# EAGLE design IO_Module (EAGLE 7.7.0)

## Sheet 1 of 3
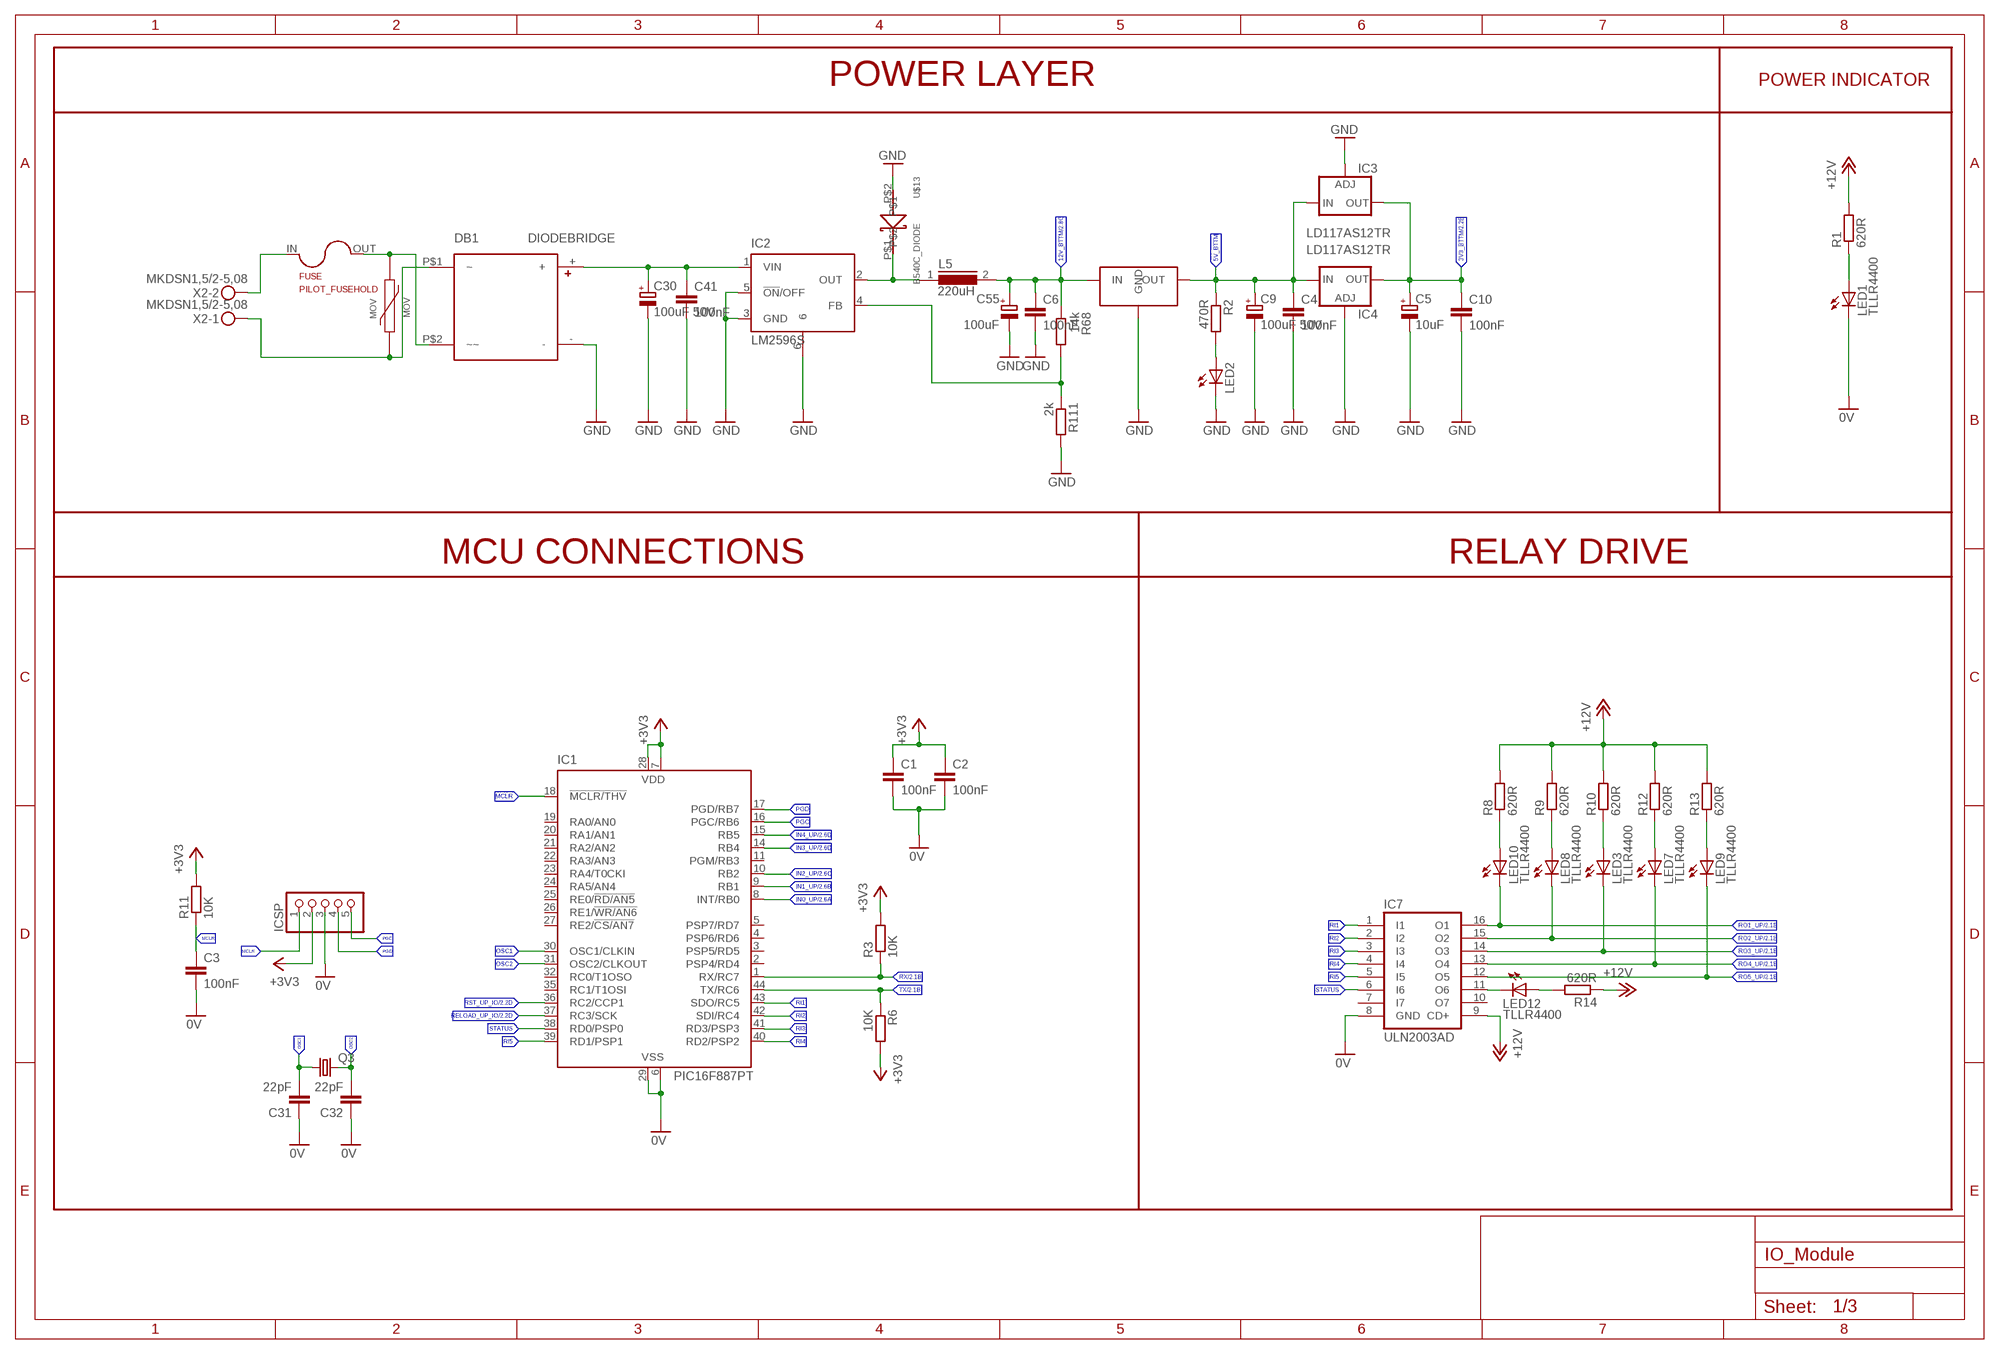
[diagram p0: schematic, sheet 1]

### Parts
C1  100nF  C-EUC0603K  [C0603K]
C2  100nF  C-EUC0603K  [C0603K]
C3  100nF  C-EUC0603K  [C0603K]
C4  100nF  C-EUC0603  [C0603]
C5  10uF  CPOL-EU153CLV-0505  [153CLV-0505]
C6  100nF  C-EUC0603  [C0603]
C9  100uF 50V  CPOL-EU153CLV-0810  [153CLV-0810]
C10  100nF  C-EUC0603  [C0603]
C30  100uF 50V  CPOL-EU153CLV-0810  [153CLV-0810]
C31  22pF  C-EUC0805  [C0805]
C32  22pF  C-EUC0805  [C0805]
C41  100nF  C-EUC0603  [C0603]
C55  100uF  CPOL-EU153CLV-0605  [153CLV-0605]
DB1  DIODEBRIDGE  [SDIP]
FUSE  PILOT_FUSEHOLD  RTM_FUSEHOLD  [RTM_FUSEHOLD]
IC1  PIC16F887PT  PIC16F877PT  [TQFP44]
IC2  LM2596S  [TO263-5]
IC3  LD117AS12TR  [SOT223]
IC4  LD117AS12TR  [SOT223]
IC7  ULN2003AD  [SO16]
ICSP  PINHD-1X5  [1X05]
L5  220uH  DR125  [DR125]
LED1  TLLR4400  [LED3MM]
LED2  LEDCHIPLED_0805  [CHIPLED_0805]
LED3  TLLR4400  [LED3MM]
LED7  TLLR4400  [LED3MM]
LED8  TLLR4400  [LED3MM]
LED9  TLLR4400  [LED3MM]
LED10  TLLR4400  [LED3MM]
LED12  TLLR4400  [LED3MM]
MOV  MOV-10D201K  [MOV-10D201K]
Q3  CRYSTALHC49UP  [HC49UP]
R1  620R  R-EU_R0805  [R0805]
R2  470R  R-EU_R0805  [R0805]
R3  10K  R-EU_R0805  [R0805]
R6  10K  R-EU_R0805  [R0805]
R8  620R  R-EU_R0805  [R0805]
R9  620R  R-EU_R0805  [R0805]
R10  620R  R-EU_R0805  [R0805]
R11  10K  R-EU_R0805  [R0805]
R12  620R  R-EU_R0805  [R0805]
R13  620R  R-EU_R0805  [R0805]
R14  620R  R-EU_R0805  [R0805]
R68  14k  R-EU_M0805  [M0805]
R111  2k  R-EU_M0805  [M0805]
U$6  L7805CD2T-TR  VREG-7805-DPAK2  [VREG-7805-DPAK2]
U$13  B540C_DIODE  [SMC]
X2  MKDSN1,5/2-5,08  [MKDSN1,5/2-5,08]

### Nets
0V: C1.2 C2.2 C3.2 C31.1 C32.1 IC1.6(VSS) IC1.29(VSS) IC7.8(GND) ICSP.3 LED1.K(C) ; also sheet 2
3V3_BTTM: C5.+ C10.1 IC3.4(OUT) IC4.4(OUT) ; also sheet 2,3
5V_BTTM: C4.1 C9.+ IC3.3(IN) IC4.3(IN) R2.1 U$6.VOUT(OUT)
12V_BTTM: C6.1 C55.+ L5.2 R68.1 U$6.VIN(IN) ; also sheet 2
36V: C30.+ C41.1 DB1.+ IC2.1(VIN)
+3V3: C1.1 C2.1 IC1.7(VDD) IC1.28(VDD) ICSP.2 R3.2 R6.2 R11.2 ; also sheet 2
+12V: IC7.9(CD+) R1.2 R8.2 R9.2 R10.2 R12.2 R13.2 R14.1 ; also sheet 2
GND: C4.2 C5.- C6.2 C9.- C10.2 C30.- C41.2 C55.- DB1.- IC2.3(GND) IC2.5(!ON!/OFF) IC2.6 IC3.1(ADJ) IC4.1(ADJ) LED2.C R111.2 U$6.GND U$13.P$2 ; also sheet 2,3
IN0_UP: IC1.8(INT/RB0) ; also sheet 2
IN1_UP: IC1.9(RB1) ; also sheet 2
IN2_UP: IC1.10(RB2) ; also sheet 2
IN3_UP: IC1.14(RB4) ; also sheet 2
IN4_UP: IC1.15(RB5) ; also sheet 2
MCLR: C3.1 IC1.18(!MCLR/THV) ICSP.1 R11.1
N$1: LED2.A R2.2
N$2: DB1.P$2(~~) FUSE.OUT MOV.2
N$3: DB1.P$1(~) MOV.1 X2.1
N$4: FUSE.IN X2.2
N$6: LED1.A R1.1
N$7: IC7.11(O6) LED12.K(C)
N$11: LED10.A R8.1
N$13: LED8.A R9.1
N$14: LED3.A R10.1
N$16: LED7.A R12.1
N$17: LED9.A R13.1
N$18: LED12.A R14.2
N$216: IC2.2(OUT) L5.1 U$13.P$1
N$219: IC2.4(FB) R68.2 R111.1
OSC1: C31.2 IC1.30(OSC1/CLKIN) Q3.1
OSC2: C32.2 IC1.31(OSC2/CLKOUT) Q3.2
PGC: IC1.16(PGC/RB6) ICSP.5
PGD: IC1.17(PGD/RB7) ICSP.4
RELOAD_UP_IO: IC1.37(RC3/SCK) ; also sheet 2
RI1: IC1.43(SDO/RC5) IC7.1(I1)
RI2: IC1.42(SDI/RC4) IC7.2(I2)
RI3: IC1.41(RD3/PSP3) IC7.3(I3)
RI4: IC1.40(RD2/PSP2) IC7.4(I4)
RI5: IC1.39(RD1/PSP1) IC7.5(I5)
RO1_UP: IC7.16(O1) LED10.K(C) ; also sheet 2
RO2_UP: IC7.15(O2) LED8.K(C) ; also sheet 2
RO3_UP: IC7.14(O3) LED3.K(C) ; also sheet 2
RO4_UP: IC7.13(O4) LED7.K(C) ; also sheet 2
RO5_UP: IC7.12(O5) LED9.K(C) ; also sheet 2
RST_UP_IO: IC1.36(RC2/CCP1) ; also sheet 2
RX: IC1.1(RX/RC7) R3.1 ; also sheet 2
STATUS: IC1.38(RD0/PSP0) IC7.6(I6)
TX: IC1.44(TX/RC6) R6.1 ; also sheet 2
Unconnected: IC1.2(PSP4/RD4) IC1.3(PSP5/RD5) IC1.4(PSP6/RD6) IC1.5(PSP7/RD7) IC1.11(PGM/RB3) IC1.19(RA0/AN0) IC1.20(RA1/AN1) IC1.21(RA2/AN2) IC1.22(RA3/AN3) IC1.23(RA4/T0CKI) IC1.24(RA5/AN4) IC1.25(RE0/!RD/AN5) IC1.26(RE1/!WR/AN6) IC1.27(RE2/!CS/AN7) IC1.32(RC0/T1OSO) IC1.35(RC1/T1OSI) IC7.7(I7) IC7.10(O7)

### Notes on the sheet
- POWER LAYER | POWER INDICATOR
- MCU CONNECTIONS | RELAY DRIVE

## Sheet 2 of 3
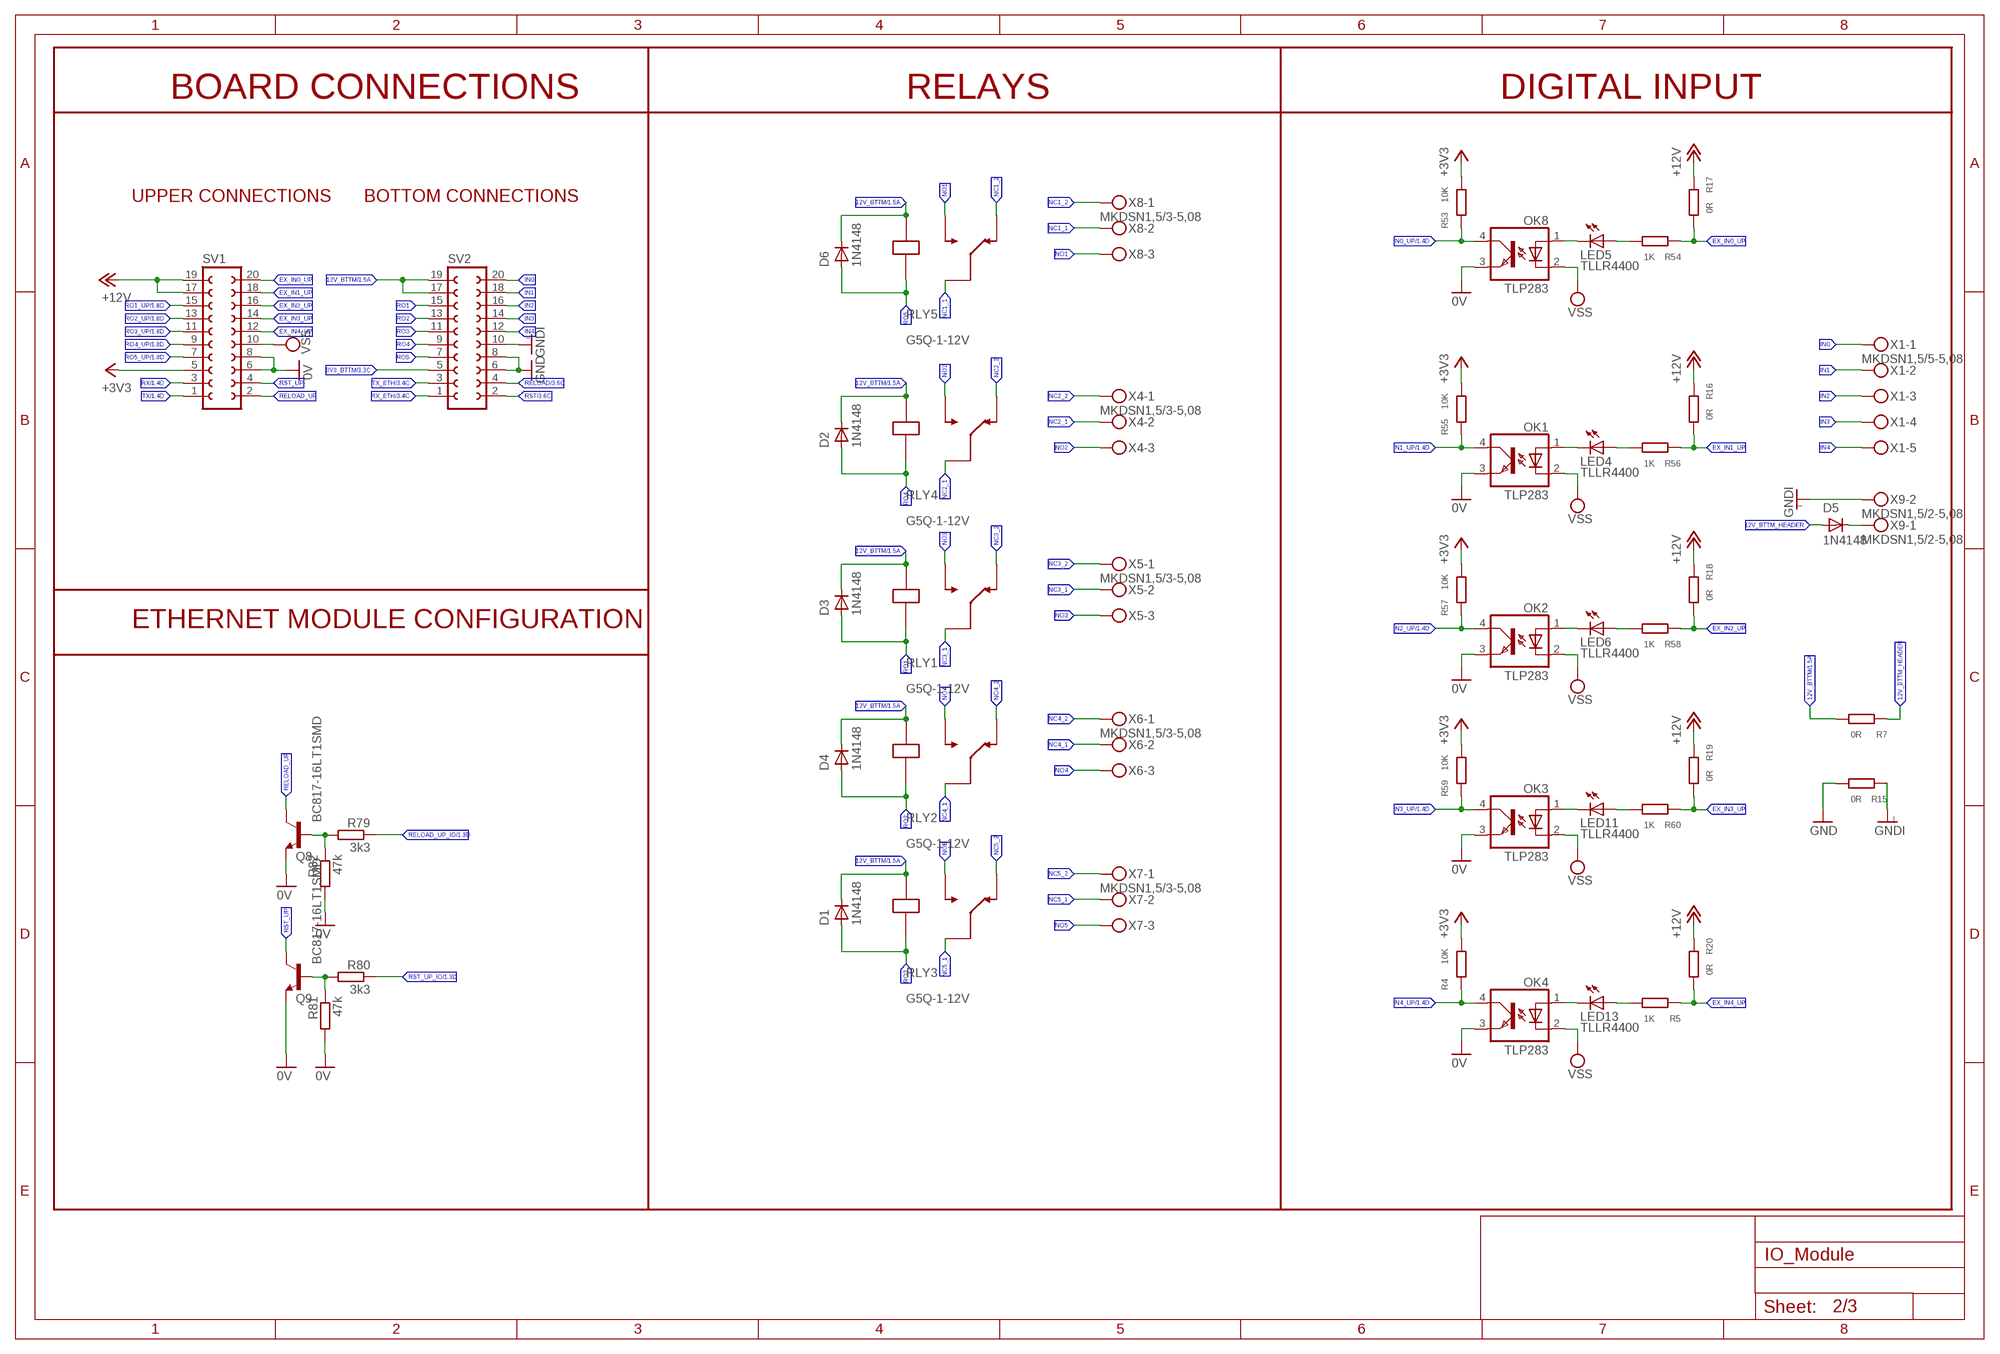
[diagram p1: schematic, sheet 2]

### Parts
D1  1N4148  GF1  [SMA-DO214AC]
D2  1N4148  GF1  [SMA-DO214AC]
D3  1N4148  GF1  [SMA-DO214AC]
D4  1N4148  GF1  [SMA-DO214AC]
D5  1N4148  GF1  [SMA-DO214AC]
D6  1N4148  GF1  [SMA-DO214AC]
LED4  TLLR4400  [LED3MM]
LED5  TLLR4400  [LED3MM]
LED6  TLLR4400  [LED3MM]
LED11  TLLR4400  [LED3MM]
LED13  TLLR4400  [LED3MM]
OK1  TLP283  [MINI-FLAT-4]
OK2  TLP283  [MINI-FLAT-4]
OK3  TLP283  [MINI-FLAT-4]
OK4  TLP283  [MINI-FLAT-4]
OK8  TLP283  [MINI-FLAT-4]
Q8  BC817-16LT1SMD  [SOT23-BEC]
Q9  BC817-16LT1SMD  [SOT23-BEC]
R4  10K  R-EU_M0805  [M0805]
R5  1K  R-EU_M0805  [M0805]
R7  0R  R-EU_M0805  [M0805]
R15  0R  R-EU_M0805  [M0805]
R16  0R  R-EU_M0805  [M0805]
R17  0R  R-EU_M0805  [M0805]
R18  0R  R-EU_M0805  [M0805]
R19  0R  R-EU_M0805  [M0805]
R20  0R  R-EU_M0805  [M0805]
R53  10K  R-EU_M0805  [M0805]
R54  1K  R-EU_M0805  [M0805]
R55  10K  R-EU_M0805  [M0805]
R56  1K  R-EU_M0805  [M0805]
R57  10K  R-EU_M0805  [M0805]
R58  1K  R-EU_M0805  [M0805]
R59  10K  R-EU_M0805  [M0805]
R60  1K  R-EU_M0805  [M0805]
R79  3k3  R-EU_R0805  [R0805]
R80  3k3  R-EU_R0805  [R0805]
R81  47k  R-EU_R0805  [R0805]
R82  47k  R-EU_R0805  [R0805]
RLY1  JW1FSN-DC12V  G5Q-1-12V  [G5Q-1-12V]
RLY2  JW1FSN-DC12V  G5Q-1-12V  [G5Q-1-12V]
RLY3  JW1FSN-DC12V  G5Q-1-12V  [G5Q-1-12V]
RLY4  JW1FSN-DC12V  G5Q-1-12V  [G5Q-1-12V]
RLY5  JW1FSN-DC12V  G5Q-1-12V  [G5Q-1-12V]
SV1  FE10-2  [FE10-2]
SV2  FE10-2  [FE10-2]
X1  MKDSN1,5/5-5,08  [MKDSN1,5/5-5,08]
X4  MKDSN1,5/3-5,08  [MKDSN1,5/3-5,08]
X5  MKDSN1,5/3-5,08  [MKDSN1,5/3-5,08]
X6  MKDSN1,5/3-5,08  [MKDSN1,5/3-5,08]
X7  MKDSN1,5/3-5,08  [MKDSN1,5/3-5,08]
X8  MKDSN1,5/3-5,08  [MKDSN1,5/3-5,08]
X9  MKDSN1,5/2-5,08  [MKDSN1,5/2-5,08]

### Nets
0V: OK1.3(EMIT) OK2.3(EMIT) OK3.3(EMIT) OK4.3(EMIT) OK8.3(EMIT) Q8.E Q9.E R81.2 R82.2 SV1.6 SV1.8 ; also sheet 1
3V3_BTTM: SV2.5 ; also sheet 1,3
12V_BTTM: D1.K(C) D2.K(C) D3.K(C) D4.K(C) D6.K(C) R7.2 RLY1.1 RLY2.1 RLY3.1 RLY4.1 RLY5.1 SV2.17 SV2.19 ; also sheet 1
12V_BTTM_HEADER: D5.A R7.1
+3V3: R4.2 R53.2 R55.2 R57.2 R59.2 SV1.5 ; also sheet 1
+12V: R16.1 R17.1 R18.1 R19.1 R20.1 SV1.17 SV1.19 ; also sheet 1
EX_IN0_UP: R17.2 R54.1 SV1.20
EX_IN1_UP: R16.2 R56.1 SV1.18
EX_IN2_UP: R18.2 R58.1 SV1.16
EX_IN3_UP: R19.2 R60.1 SV1.14
EX_IN4_UP: R5.1 R20.2 SV1.12
GND: R15.2 SV2.6 SV2.8 ; also sheet 1,3
GNDI: R15.1 SV2.10 X9.2
IN0: SV2.20 X1.1
IN0_UP: OK8.4(COL) R53.1 ; also sheet 1
IN1: SV2.18 X1.2
IN1_UP: OK1.4(COL) R55.1 ; also sheet 1
IN2: SV2.16 X1.3
IN2_UP: OK2.4(COL) R57.1 ; also sheet 1
IN3: SV2.14 X1.4
IN3_UP: OK3.4(COL) R59.1 ; also sheet 1
IN4: SV2.12 X1.5
IN4_UP: OK4.4(COL) R4.1 ; also sheet 1
N$5: LED13.K(C) OK4.1(A)
N$10: LED13.A R5.2
N$12: D5.K(C) X9.1
N$46: LED5.K(C) OK8.1(A)
N$47: LED5.A R54.2
N$49: LED4.K(C) OK1.1(A)
N$50: LED4.A R56.2
N$51: LED6.K(C) OK2.1(A)
N$52: LED6.A R58.2
N$53: LED11.K(C) OK3.1(A)
N$54: LED11.A R60.2
NC1_1: RLY5.3 X8.2
NC1_2: RLY5.4 X8.1
NC2_1: RLY4.3 X4.2
NC2_2: RLY4.4 X4.1
NC3_1: RLY1.3 X5.2
NC3_2: RLY1.4 X5.1
NC4_1: RLY2.3 X6.2
NC4_2: RLY2.4 X6.1
NC5_1: RLY3.3 X7.2
NC5_2: RLY3.4 X7.1
NO1: RLY5.5 X8.3
NO2: RLY4.5 X4.3
NO3: RLY1.5 X5.3
NO4: RLY2.5 X6.3
NO5: RLY3.5 X7.3
RELOAD: SV2.4 ; also sheet 3
RELOAD_UP: Q8.C SV1.2
RELOAD_UP_IO: R79.1 ; also sheet 1
RO1: D3.A RLY1.2 SV2.15
RO1_UP: SV1.15 ; also sheet 1
RO2: D4.A RLY2.2 SV2.13
RO2_UP: SV1.13 ; also sheet 1
RO3: D1.A RLY3.2 SV2.11
RO3_UP: SV1.11 ; also sheet 1
RO4: D2.A RLY4.2 SV2.9
RO4_UP: SV1.9 ; also sheet 1
RO5: D6.A RLY5.2 SV2.7
RO5_UP: SV1.7 ; also sheet 1
RST: SV2.2 ; also sheet 3
RST_UP: Q9.C SV1.4
RST_UP_IO: R80.1 ; also sheet 1
RX: SV1.3 ; also sheet 1
RX_ETH: SV2.1 ; also sheet 3
TX: SV1.1 ; also sheet 1
TX_ETH: SV2.3 ; also sheet 3
TXD2: Q8.B R79.2 R82.1
TXD3: Q9.B R80.2 R81.1
VSS: OK1.2(C) OK2.2(C) OK3.2(C) OK4.2(C) OK8.2(C) SV1.10

### Notes on the sheet
- BOARD CONNECTIONS | RELAYS | DIGITAL INPUT
- UPPER CONNECTIONS | BOTTOM CONNECTIONS
- ETHERNET MODULE CONFIGURATION

## Sheet 3 of 3
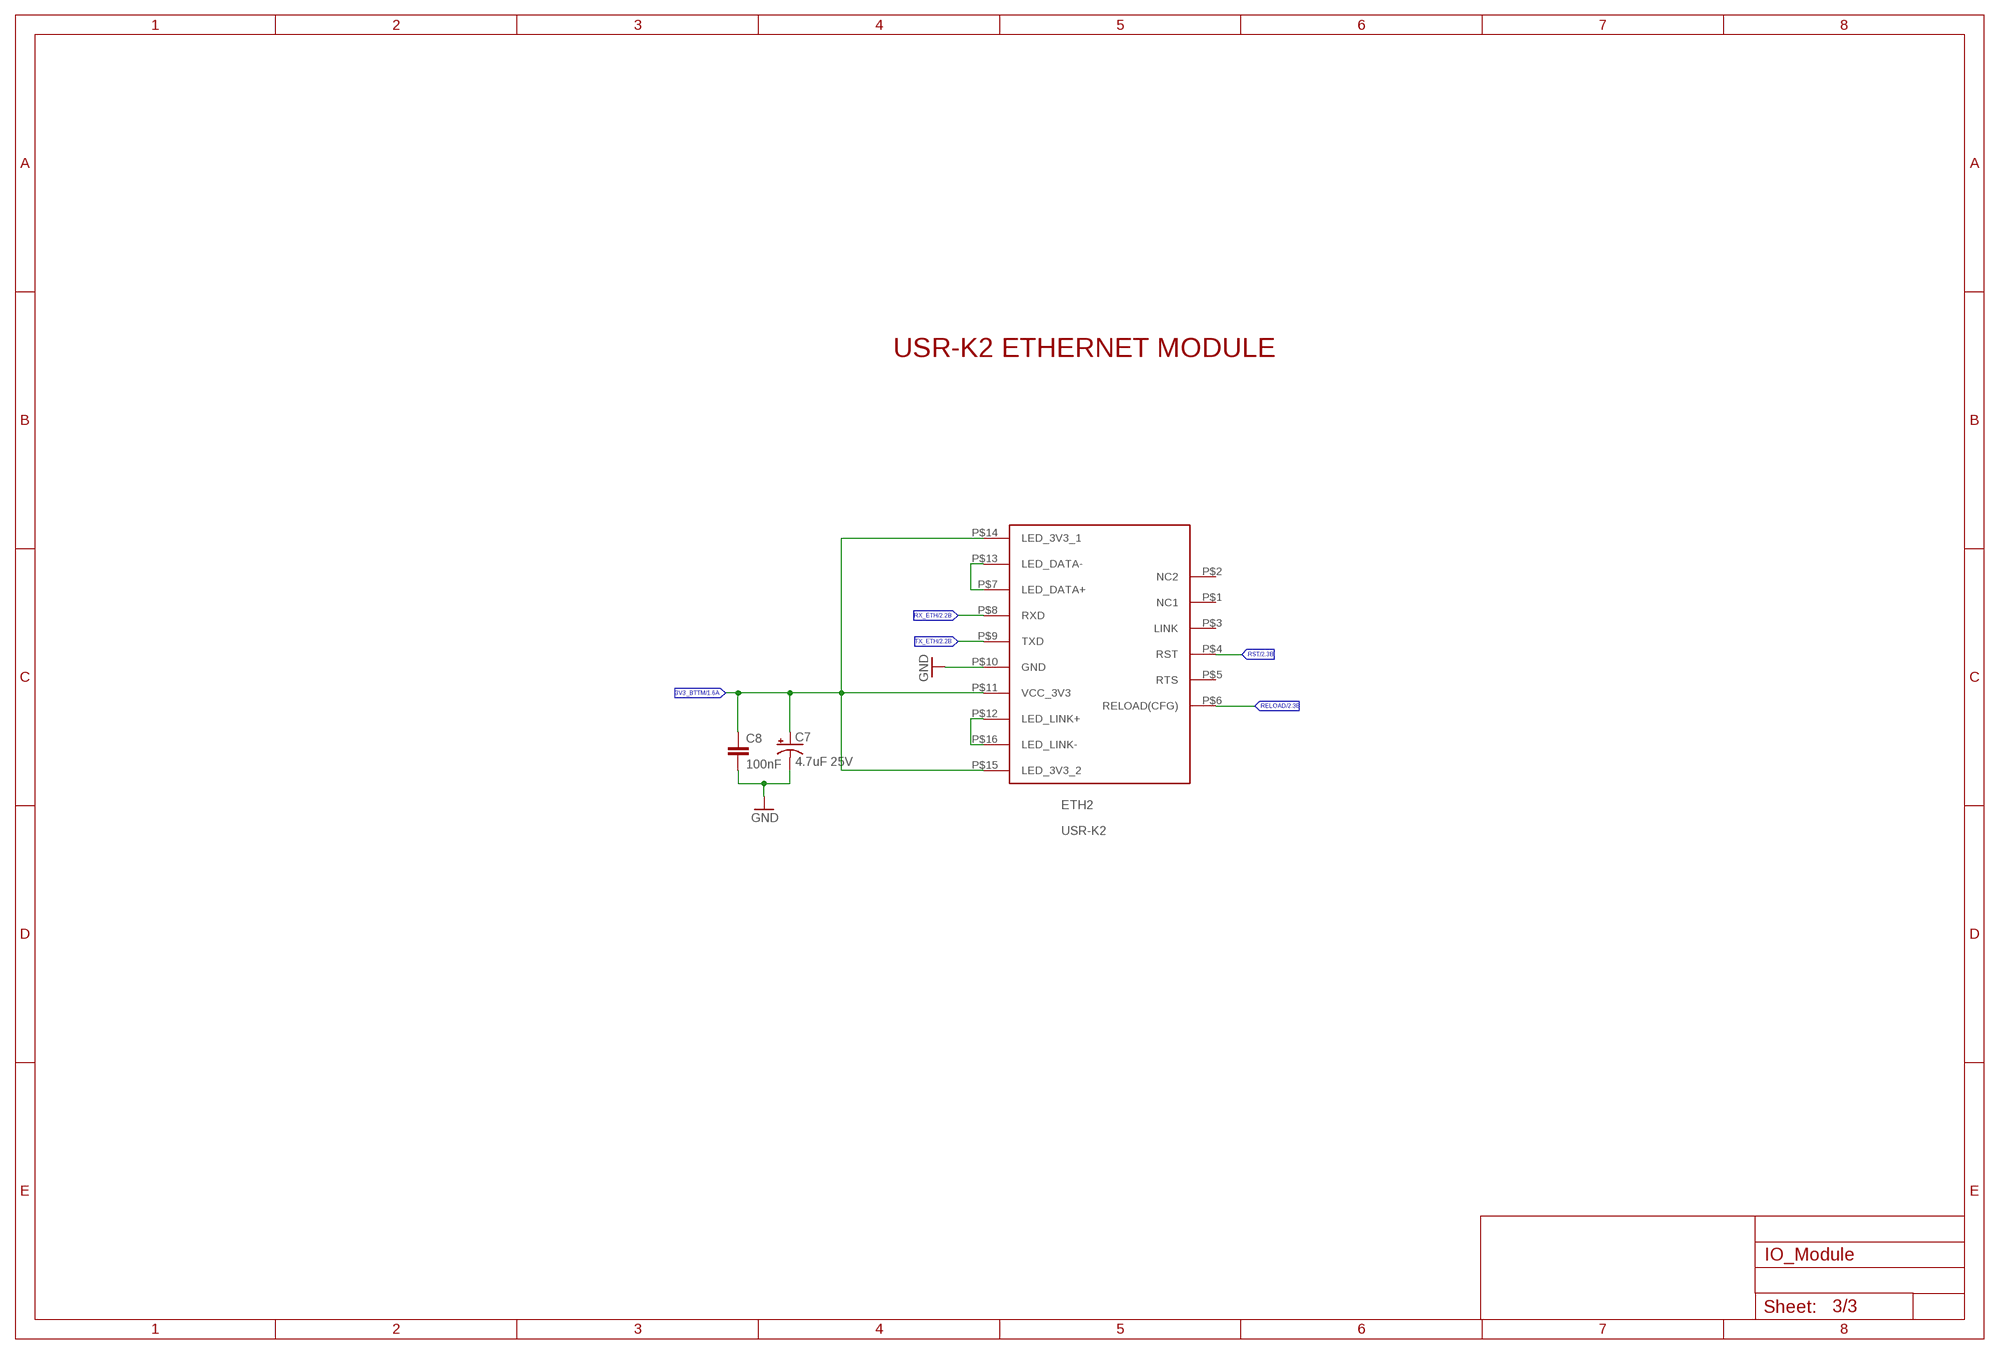
[diagram p2: schematic, sheet 3]

### Parts
C7  4.7uF 25V  CPOL-USA/3216-18R  [A/3216-18R]
C8  100nF  C-EUC0603  [C0603]
ETH2  USR-K2  [USR-K2]

### Nets
3V3_BTTM: C7.+ C8.1 ETH2.P$11(VCC_3V3) ETH2.P$14(LED_3V3_1) ETH2.P$15(LED_3V3_2) ; also sheet 1,2
GND: C7.- C8.2 ETH2.P$10(GND) ; also sheet 1,2
N$8: ETH2.P$12(LED_LINK+) ETH2.P$16(LED_LINK-)
N$9: ETH2.P$7(LED_DATA+) ETH2.P$13(LED_DATA-)
RELOAD: ETH2.P$6(RELOAD(CFG)) ; also sheet 2
RST: ETH2.P$4(RST) ; also sheet 2
RX_ETH: ETH2.P$8(RXD) ; also sheet 2
TX_ETH: ETH2.P$9(TXD) ; also sheet 2
Unconnected: ETH2.P$1(NC1) ETH2.P$2(NC2) ETH2.P$3(LINK) ETH2.P$5(RTS)

### Notes on the sheet
- USR-K2 ETHERNET MODULE

## Library data of the parts
C1-C4 C6 C8 C10 C31 C32 C41 = rcl:C-EU: CAPACITOR, European symbol
C5 C9 C30 C55 = rcl:CPOL-EU: POLARIZED CAPACITOR, European symbol
C7 = rcl:CPOL-US: POLARIZED CAPACITOR, American symbol
D1-D6 = diode:GF1: DIODE
DB1 = Alihan_1_lib:DIODEBRIDGE
ETH2 = USR-K2:USR-K2
FUSE = RTM_FUSEHOLDER:RTM_FUSEHOLD
IC1 = microchip:PIC16F87*: MICROCONTROLLER; MF: MICROCHIP; MPN: PIC16F877-04/PQ; OC_FARNELL: 9761411; OC_NEWARK: 23C5094
IC2 = Aktif_Lib:LM2596: SIMPLE SWITCHER® Power Converter 150 kHz 3A Step-Down Voltage Regulator Source: http://www.national.com/ds/LM/LM2596.pdf; MF: NATIONAL SEMICONDUCTOR; MPN: LM2596S-ADJ/NOPB; OC_FARNELL: 9494367; OC_NEWARK: 41K3842
IC3 IC4 = v-reg:LD117A?*: Low drop fixed and adjustable positive voltage regulators 1 A Source: http://www.st.com/stonline/products/literature/ds/7194/ld1117axx.pdf
IC7 = uln-udn:ULN2003A: DRIVER ARRAY
ICSP = pinhead:PINHD-1X5: PIN HEADER
L5 = inductors:DR125: High Power Density, High Efficiency, Shielded Inductors Source: coiltronics_dr_series.pdf
LED1 LED3-LED13 = led:TLLR4400: Low Current (2mA) LED 3 mm Tinted Diffused Package color RED Source: Data sheet <http://www.farnell.com/datasheets/391100.pdf>; MF: VISHAY SEMICONDUCTOR; OC_FARNELL: 1612437
LED2 = led:LED: LED OSRAM: - CHIPLED LG R971, LG N971, LY N971, LG Q971, LY Q971, LO R971, LY R971 LH N974, LH R974 LS Q976, LO Q976, LY Q976 LO Q996 - Hyper CHIPLED LW Q18S LB Q993, LB Q99A, LB R99A - SideLED LS A670, LO A670, LY A670, LG A670, LP A670 LB A673, LV A673, LT A673, LW A673 LH A674 LY A675 LS A676, LA A676, LO A676, LY A676, LW A676 LS A679, LY A679, LG A679 - Hyper Micro SIDELED® LS Y876, LA Y876, LO Y876, LY Y876 LT Y87S - SmartLED LW L88C, LW L88S LB L89C, LB L89S, LG L890 LS L89K, LO L89K, LY L89K LS L896, LA L896, LO L896, LY L896 - TOPLED LS T670, LO T670, LY T670, LG T670, LP T670 LSG T670, LSP T670, LSY T670, LOP T670, LYG T670 LG T671, LOG T671, LSG T671 LB T673, LV T673, LT T673, LW T673 LH T674 LS T676, LA T676, LO T676, LY T676, LB T676, LH T676, LSB T676, LW T676 LB T67C, LV T67C, LT T67C, LS T67K, LO T67K, LY T67K, LW E67C LS E67B, LA E67B, LO E67B, LY E67B, LB E67C, LV E67C, LT E67C LW T67C LS T679, LY T679, LG T679 LS T770, LO T770, LY T770, LG T770, LP T770 LB T773, LV T773, LT T773, LW T773 LH T774 LS E675, LA E675, LY E675, LS T675 LS T776, LA T776, LO T776, LY T776, LB T776 LHGB T686 LT T68C, LB T68C - Hyper Mini TOPLED® LB M676 - Mini TOPLED Santana® LG M470 LS M47K, LO M47K, LY M47K Source: http://www.osram.convergy.de LUXEON: - LUMILED® LXK2-PW12-R00, LXK2-PW12-S00, LXK2-PW14-U00, LXK2-PW14-V00 LXK2-PM12-R00, LXK2-PM12-S00, LXK2-PM14-U00 LXK2-PE12-Q00, LXK2-PE12-R00, LXK2-PE12-S00, LXK2-PE14-T00, LXK2-PE14-U00 LXK2-PB12-K00, LXK2-PB12-L00, LXK2-PB12-M00, LXK2-PB14-N00, LXK2-PB14-P00, LXK2-PB14-Q00 LXK2-PR12-L00, LXK2-PR12-M00, LXK2-PR14-Q00, LXK2-PR14-R00 LXK2-PD12-Q00, LXK2-PD12-R00, LXK2-PD12-S00 LXK2-PH12-R00, LXK2-PH12-S00 LXK2-PL12-P00, LXK2-PL12-Q00, LXK2-PL12-R00 Source: www.luxeon.com KINGBRIGHT: KA-3528ASYC Source: www.kingbright.com
MOV = Aktif_Lib:MOV-10D201K
OK1-OK4 OK8 = optocoupler-2:TLP283: TOSHIBA PHOTOCOUPLER GaAs IRED & PHOTO-TRANSISTOR Source: http://www.semicon.toshiba.co.jp/td/en/Opto/Photocoupler/en_20050928_TLP283_datasheet.pdf
Q3 = crystal:CRYSTAL: CRYSTAL; OC_FARNELL: unknown; OC_NEWARK: unknown
Q8 Q9 = transistor-npn:BC817*: NPN Transistor
R1-R20 R53-R60 R68 R79-R82 R111 = rcl:R-EU_: RESISTOR, European symbol
RLY1-RLY5 = OMRON:G5Q-1-12V
SV1 SV2 = con-lsta:FE10-2: FEMALE HEADER; OC_FARNELL: unknown; OC_NEWARK: unknown
U$6 = vreg-7805-dpak2:VREG-7805-DPAK2
U$13 = Alihan_1_lib:B540C_DIODE
X1 = con-phoenix-508:MKDSN1,5/5-5,08: MKDSN 1,5/ 5-5,08 Printklemme Nennstrom: 13,5 A Nennspannung: 250 V Rastermaß: 5,08 mm Polzahl: 5 Anschlussart: Schraubanschluss Montage: Löten Anschlussrichtung Leiter/Platine: 0 ° Artikelnummer: 1729157 Source: http://eshop.phoenixcontact.com .. 1729157.pdf
X2 X9 = con-phoenix-508:MKDSN1,5/2-5,08: MKDSN 1,5/ 2-5,08 Printklemme Nennstrom: 13,5 A Nennspannung: 250 V Rastermaß: 5,08 mm Polzahl: 2 Anschlussart: Schraubanschluss Montage: Löten Anschlussrichtung Leiter/Platine: 0 ° Artikelnummer: 1729128 Source: http://eshop.phoenixcontact.com .. 1729128.pdf
X4-X8 = con-phoenix-508:MKDSN1,5/3-5,08: MKDSN 1,5/ 3-5,08 Printklemme Nennstrom: 13,5 A Nennspannung: 250 V Rastermaß: 5,08 mm Polzahl: 3 Anschlussart: Schraubanschluss Montage: Löten Anschlussrichtung Leiter/Platine: 0 ° Artikelnummer: 1729131 Source: http://eshop.phoenixcontact.com .. 1729131.pdf

## Board
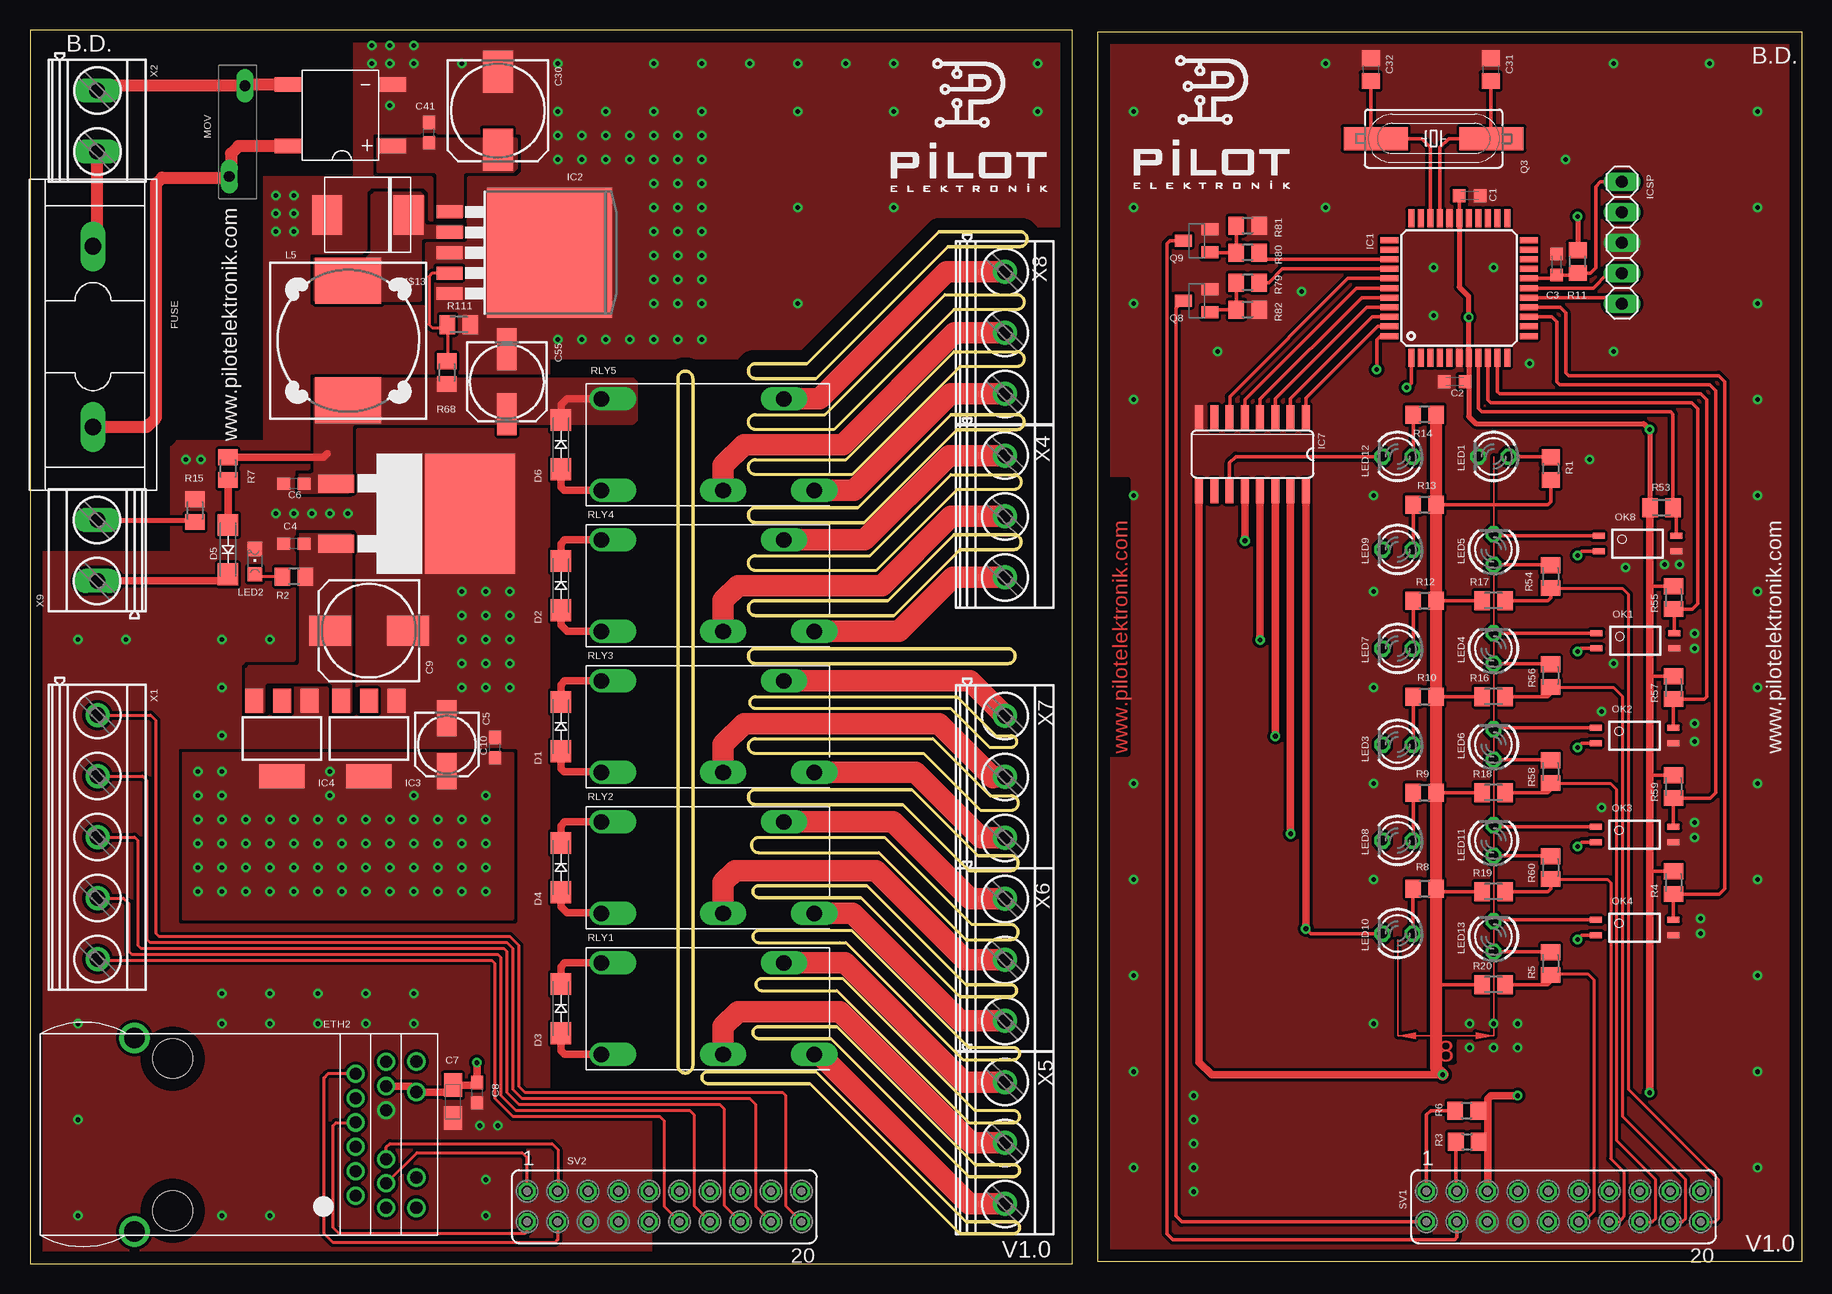
[diagram p3: board, top side]
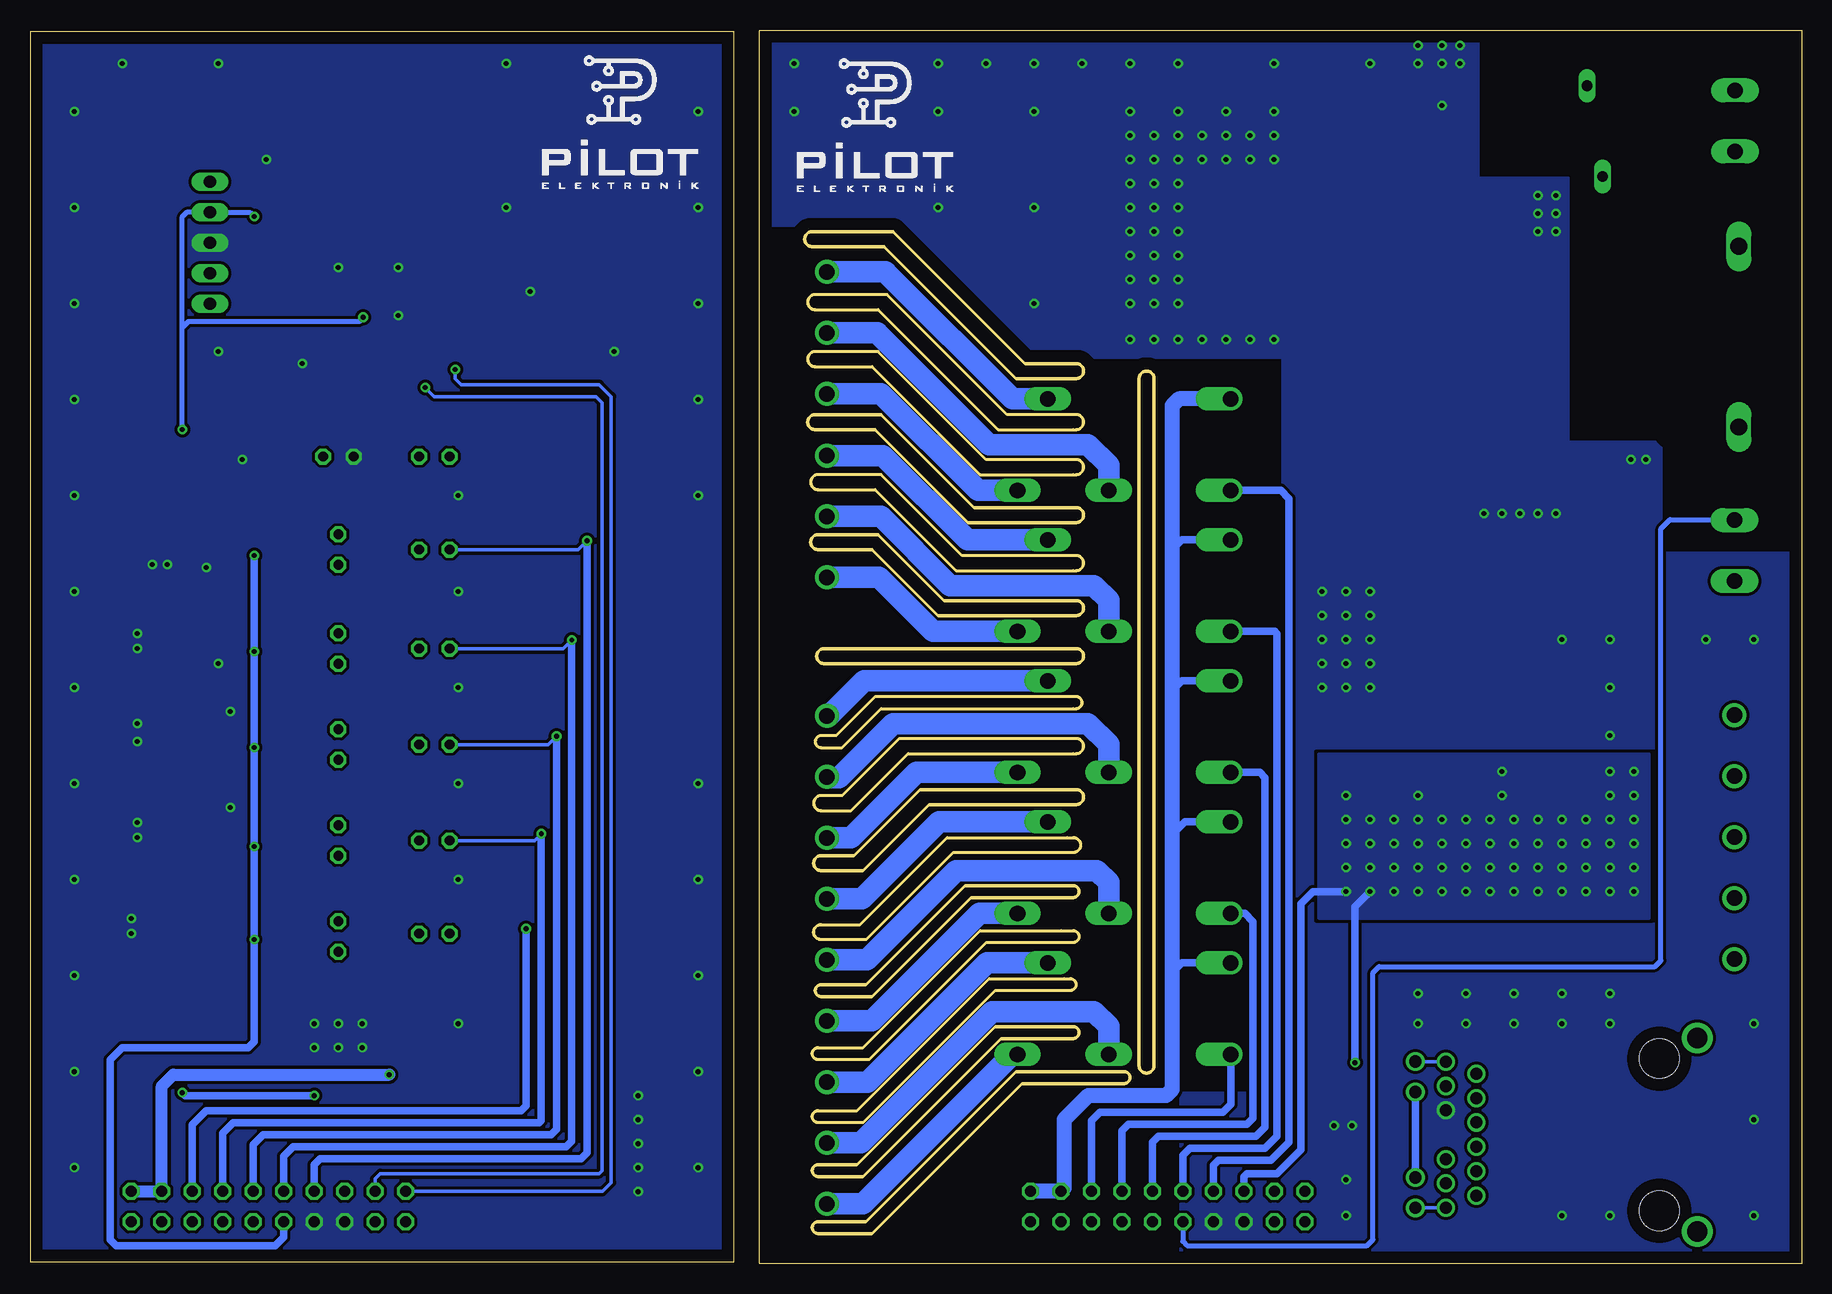
[diagram p4: board, bottom side, seen from below]

Size 147.7 x 102.8 mm. Coordinates in mm from the lower left corner, seen from the top.
Outline: 0,0 86.9,0 86.9,102.8 0,102.8 0,0
Outline: 89,0.15 89,102.65 147.7,102.65 147.7,0.15 89,0.15
Outline: 60.5,73.75 65.5,73.75 76.5,84.75 82.5,84.75 arc180 82.5,86 75.75,86 64.75,75 60.5,75 arc180 60.5,73.75
Outline: 60.5,70.75 66.25,70.75 76.25,80.75 82.25,80.75 arc-180 82.25,79.5 77,79.5 67,69.5 60.5,69.5 arc-180 60.5,70.75
Outline: 60.5,67 68,67 77,76 82.25,76 arc-180 82.25,74.75 77.5,74.75 68.5,65.75 60.5,65.75 arc-180 60.5,67
Outline: 60.5,63 69,63 76.75,70.75 82.25,70.75 arc-180 82.25,69.5 77.25,69.5 69.5,61.75 60.5,61.75 arc-180 60.5,63
Outline: 60.5,59 70,59 76.75,65.75 82,65.75 arc-180 82,64.5 77.25,64.5 70.5,57.75 60.5,57.75 arc-180 60.5,59
Outline: 60.5,55.25 71.5,55.25 77,60.75 82,60.75 arc-180 82,59.5 77.5,59.5 72,54 60.5,54 arc-180 60.5,55.25
Outline: 60.5,51.25 81.5,51.25 arc-180 81.5,50 60.5,50 arc-180 60.5,51.25
Outline: 60.5,47.25 77.25,47.25 80.5,44 81.75,44 arc-180 81.75,43 80,43 76.75,46.25 60.5,46.25 arc-180 60.5,47.25
Outline: 60.5,43.75 75.25,43.75 80,39 81.75,39 arc-180 81.75,37.75 79.25,37.75 74.5,42.5 60.5,42.5 arc-180 60.5,43.75
Outline: 60.5,39.5 73.5,39.5 79,34 81.75,34 arc-180 81.75,32.75 78.25,32.75 72.75,38.25 60.5,38.25 arc-180 60.5,39.5
Outline: 60.75,35.5 arc180 60.75,34.25 70.75,34.25 78,27 81.75,27 arc180 81.75,28.25 78.5,28.25 71.25,35.5 60.75,35.5
Outline: 60.75,31.5 arc180 60.75,30.5 69.25,30.5 77.5,22.25 81.75,22.25 arc180 81.75,23.25 78,23.25 69.75,31.5 60.75,31.5
Outline: 60.75,27.75 arc180 60.75,26.75 68,26.75 77.75,17 82,17 arc180 82,18 78.25,18 68.5,27.75 60.75,27.75
Outline: 61,23.75 arc180 61,22.75 67.25,22.75 78.25,11.75 82,11.75 arc180 82,12.75 78.75,12.75 67.75,23.75 61,23.75
Outline: 60.75,19.75 67.25,19.75 78.75,8.25 82,8.25 arc-180 82,7.25 78.25,7.25 66.75,18.75 60.75,18.75 arc-180 60.75,19.75
Outline: 65.5,16 56.5,16 arc180 56.5,15 65,15 77.5,2.5 82,2.5 arc180 82,3.5 78,3.5 65.5,16
Outline: 54,16.5 54,73.75 arc-180 55.25,73.75 55.25,16.5 arc-180 54,16.5
Copper layers (1*16): Top 0.035mm / dielectric 1.5mm / Bottom 0.035mm
Design rules "default": minimum track width 10mil, minimum drill 24mil, track to track 8mil, track to pad 8mil, pad to pad 8mil, via to via 8mil, smd to smd 8mil, copper to edge 40mil, drill to drill 8mil, minimum pad ring 10mil, minimum via ring 8mil, stop-mask expansion 4mil, vias tented up to drill 0mil, thermal gap 10mil
Milling: area 59.9,73.8 to 83.1,86; area 59.9,69.5 to 82.9,80.8; area 59.9,65.8 to 82.9,76; area 59.9,61.8 to 82.9,70.8; area 59.9,57.8 to 82.6,65.8; area 59.9,54 to 82.6,60.8; area 59.9,50 to 82.1,51.2; area 60,43 to 82.2,47.2; area 59.9,37.8 to 82.4,43.8; area 59.9,32.8 to 82.4,39.5; area 60.1,27 to 82.4,35.5; area 60.2,22.2 to 82.2,31.5; area 60.2,17 to 82.5,27.8; area 60.5,11.8 to 82.5,23.8; area 60.2,7.2 to 82.5,19.8; area 56,2.5 to 82.5,16; area 54,15.9 to 55.2,74.4

### Footprints (pad centres in the part's own frame; a part is rotated, then mirrored left to right if it is on the bottom)
C0603K = smd 1.05 x 1.08: 1 -0.875,0; 2 0.875,0
C0603 = smd 1.1 x 1: 1 -0.85,0; 2 0.85,0
153CLV-0505 = smd 3 x 1.6: + 2.2,0; - -2.2,0
A/3216-18R = smd 1.95 x 1.5: + 1.375,0; - -1.375,0
153CLV-0810 = smd 3.5 x 2.5: + 3.25,0; - -3.25,0
C0805 = smd 1.3 x 1.5: 1 -0.95,0; 2 0.95,0
153CLV-0605 = smd 3.5 x 1.6: + 2.7,0; - -2.7,0
SMA-DO214AC = smd 1.8 x 1.7: A -2.05,0; K 2.05,0
SDIP = smd 2.22 x 1.2: + -8.73,5.12; - -8.73,0; P$1 0,0; P$2 0,5.12
USR-K2 = drill 1: P$1 -8.89,5.08; P$2 -8.89,3.05; P$3 -8.89,1.02; P$4 -8.89,-1.01; P$5 -8.89,-3.04; P$6 -8.89,-5.07; P$7 -11.43,6.1; P$8 -11.43,4.07; P$9 -11.43,2.04; P$10 -11.43,-2.02; P$11 -11.43,-4.05; P$12 -11.43,-6.08 | drill 1.03: P$13 -13.97,6.1; P$14 -13.97,3.56; P$15 -13.97,-3.54; P$16 -13.97,-6.08 | drill 1.7: P$17 9.53,8.065; P$18 9.53,-8.055 | hole 3.3: 6.35,6.35; 6.35,-6.34
RTM_FUSEHOLD = drill 1.4 long: IN -7.52,0; OUT 7.53,0
TQFP44 = smd 1.5 x 0.5: 1 -5.8,4; 2 -5.8,3.2; 3 -5.8,2.4; 4 -5.8,1.6; 5 -5.8,0.8; 6 -5.8,0; 7 -5.8,-0.8; 8 -5.8,-1.6; 9 -5.8,-2.4; 10 -5.8,-3.2; 11 -5.8,-4; 23 5.8,-4; 24 5.8,-3.2; 25 5.8,-2.4; 26 5.8,-1.6; 27 5.8,-0.8; 28 5.8,0; 29 5.8,0.8; 30 5.8,1.6; 31 5.8,2.4; 32 5.8,3.2; 33 5.8,4 | smd 0.5 x 1.5: 12 -4,-5.8; 13 -3.2,-5.8; 14 -2.4,-5.8; 15 -1.6,-5.8; 16 -0.8,-5.8; 17 0,-5.8; 18 0.8,-5.8; 19 1.6,-5.8; 20 2.4,-5.8; 21 3.2,-5.8; 22 4,-5.8; 34 4,5.8; 35 3.2,5.8; 36 2.4,5.8; 37 1.6,5.8; 38 0.8,5.8; 39 0,5.8; 40 -0.8,5.8; 41 -1.6,5.8; 42 -2.4,5.8; 43 -3.2,5.8; 44 -4,5.8
TO263-5 = smd 1.067 x 2.159: 1 -3.404,-5.791; 2 -1.702,-5.791; 3 0,-5.791; 4 1.702,-5.791; 5 3.404,-5.791 | smd 10.8 x 10.41: 6 0,2.54
SOT223 = smd 1.5 x 2: 1 -2.3,-3.15; 2 0,-3.15; 3 2.3,-3.15 | smd 3.8 x 2: 4 0,3.15
SO16 = smd 0.66 x 2.032: 1 -4.445,-3.073; 2 -3.175,-3.073; 3 -1.905,-3.073; 4 -0.635,-3.073; 5 0.635,-3.073; 6 1.905,-3.073; 7 3.175,-3.073; 8 4.445,-3.073; 9 4.445,3.073; 10 3.175,3.073; 11 1.905,3.073; 12 0.635,3.073; 13 -0.635,3.073; 14 -1.905,3.073; 15 -3.175,3.073; 16 -4.445,3.073
1X05 = drill 1.016 long: 1 -5.08,0; 2 -2.54,0; 3 0,0; 4 2.54,0; 5 5.08,0
DR125 = smd 3.85 x 5.5: 1 -4.975,0; 2 4.975,0
LED3MM = drill 0.813 octagon: A -1.27,0; K 1.27,0
CHIPLED_0805 = smd 1.2 x 1.2: A 0,-1.05; C 0,1.05
MOV-10D201K = drill 0.9 long: 1 -3.79,0; 2 3.77,-1.3
MINI-FLAT-4 = smd 1 x 0.5: 1 -3.24,0.635; 2 -3.24,-0.635; 3 3.24,-0.635; 4 3.24,0.635
HC49UP = smd 5.334 x 1.93: 1 -4.826,0; 2 4.826,0
SOT23-BEC = smd 1 x 1.4: B -0.95,-1.1; C 0,1.1; E 0.95,-1.1
R0805 = smd 1.3 x 1.5: 1 -0.95,0; 2 0.95,0
M0805 = smd 1.3 x 1.6: 1 -0.95,0; 2 0.95,0
G5Q-1-12V = drill 1.3 offset: 1 -8.89,3.81; 2 -8.89,-3.81 | drill 1.3 long: 3 1.27,-3.81; 4 6.35,3.81; 5 8.89,-3.81
FE10-2 = drill 0.914 octagon: 1 -11.43,1.27; 2 -11.43,-1.27; 3 -8.89,1.27; 4 -8.89,-1.27; 5 -6.35,1.27; 6 -6.35,-1.27; 7 -3.81,1.27; 8 -3.81,-1.27; 9 -1.27,1.27; 10 -1.27,-1.27; 11 1.27,1.27; 12 1.27,-1.27; 13 3.81,1.27; 14 3.81,-1.27; 15 6.35,1.27; 16 6.35,-1.27; 17 8.89,1.27; 18 8.89,-1.27; 19 11.43,1.27; 20 11.43,-1.27
VREG-7805-DPAK2 = smd 10 x 7.5: GND 0,8.7 | smd 1.5 x 3: VIN -2.5,-2.5; VOUT 2.5,-2.5
SMC = smd 2.5 x 3.3: P$1 -3.62,-0.18; P$2 3.18,-0.18
MKDSN1,5/5-5,08 = drill 1.3 pad 2: 1 -10.181,0.025; 2 -5.101,0.025; 3 -0.021,0.025; 4 5.059,0.025; 5 10.139,0.025
MKDSN1,5/2-5,08 = drill 1.3 pad 2 long: 1 -2.565,-0.021; 2 2.515,-0.021
MKDSN1,5/3-5,08 = drill 1.3 pad 2: 1 -7.641,0.025; 2 -2.561,0.025; 3 2.519,0.025

### Placement (x,y rotation side)
C1  120,89 0 top
C2  118.75,73.5 180 top
C3  127.25,83.25 90 top
C4  22,60 180 top
C5  34.75,43.25 270 top
C6  22,65 180 top
C7  35.25,13.5 90 top
C8  37.25,14.25 270 top
C9  28.25,52.75 180 top
C10  38.75,43 90 top
C30  39,96.08 270 top
C31  121.75,99.5 270 top
C32  111.75,99.5 270 top
C41  33.25,94.25 90 top
C55  39.75,73.5 270 top
D1  44.25,44.75 90 top
D2  44.25,56.5 90 top
D3  44.25,21.25 90 top
D4  44.25,33 90 top
D5  16.5,59.5 270 top
D6  44.25,68.25 90 top
DB1  21.5,98.25 180 top
ETH2  18.25,10.75 180 top
FUSE  5.25,77.25 270 top
IC1  119.12,81.3 90 top
IC2  40.76,84.24 270 top
IC3  28.25,43.75 180 top
IC4  21,43.75 180 top
IC7  101.9,67.45 180 top
ICSP  132.7,85.07 270 top
L5  26.54,76.92 270 top
LED1  122,67.25 180 top
LED2  18.75,58.5 0 top
LED3  114,43.25 180 top
LED4  122,51.25 90 top
LED5  122,59.5 90 top
LED6  122,43.25 90 top
LED7  114,51.25 180 top
LED8  114,35.25 180 top
LED9  114,59.5 180 top
LED10  114,27.5 180 top
LED11  122,35.25 90 top
LED12  114,67.25 180 top
LED13  122,27.25 90 top
MOV  17.91,94.36 270 top
OK1  133.81,51.9 0 top
OK2  133.75,44 0 top
OK3  133.75,35.75 0 top
OK4  133.75,28 0 top
OK8  134,60 0 top
Q3  117,93.75 180 top
Q8  97.25,80.25 90 top
Q9  97.25,85.25 90 top
R1  126.75,66.25 270 top
R2  22,57.25 180 top
R3  119.8,10.16 0 top
R4  137,31.75 90 top
R5  126.75,25 90 top
R6  119.75,12.75 0 top
R7  16.5,66.25 90 top
R8  116.25,31.25 0 top
R9  116.25,39.25 0 top
R10  116.25,47.25 0 top
R11  129,83.5 90 top
R12  116.25,55.25 0 top
R13  116.25,63.25 0 top
R14  116.25,70.75 180 top
R15  13.75,62.75 90 top
R16  122,47.25 0 top
R17  122,55.25 0 top
R18  122,39.25 0 top
R19  122,31 0 top
R20  122,23.25 0 top
R53  136,63 180 top
R54  126.75,57.25 90 top
R55  137,55.5 90 top
R56  126.75,49 90 top
R57  137,48 90 top
R58  126.75,41 90 top
R59  137,39.75 90 top
R60  126.75,33 90 top
R68  34.75,74.25 90 top
R79  101.5,81.75 180 top
R80  101.5,84.25 180 top
R81  101.5,86.5 0 top
R82  101.5,79.5 0 top
R111  35.75,78.25 0 top
RLY1  56.5,21.25 0 top
RLY2  56.5,33 0 top
RLY3  56.5,44.75 0 top
RLY4  56.5,56.5 0 top
RLY5  56.5,68.25 0 top
SV1  127.83,4.75 0 top
SV2  52.88,4.75 0 top
U$6  28,62.5 270 top
U$13  27.94,87.22 180 top
X1  5.6,35.52 270 top
X2  5.6,95.2 270 top
X4  81.25,59.7 270 top
X5  81.25,7.49 270 top
X6  81.25,22.75 270 top
X7  81.25,38 270 top
X8  81.25,75 270 top
X9  5.6,59.45 90 top

### Tracks (layer width: path | path; a pad name or v marks a point on that pad's centre or on a via)
0V  (via drill 0.4)
  other vias: 136.25,58.25 137.5,58.25 138.75,52.5 138.75,51.25 138.75,45 138.75,43.5 138.75,36.75 138.75,35.5 139.25,28.75 139.25,27.5 92,32 92,40 92,24 92,16 92,8 92,64 92,72 92,80 92,88 92,96 144,96 144,88 144,80 144,72 144,64 144,56 144,48 144,40 144,32 144,24 144,16 144,8 124,20 120,20 112,20 112,32 112,40 112,48 112,56 112,64 140,100 132,100 108,100 128,92 108,88 106,81 99,76 117,83 117,79 122,83 132,76 125,75 130,67 133,58 132,50 131,46 131,38 97,12 97,8 97,10 97,14 97,6 120,18 122,18 122,20 124,18
  pour Bottom (isolate 0.254, rank 2, no thermals): 89,102.5 89,0.25 147.75,0.25 147.75,102.5
  pour Top (isolate 0.254, rank 2, no thermals): 89,102.5 89,0.25 147.75,0.25 147.75,102.5
3V3_BTTM  (via drill 0.4)
  Top 0.61: v37.25,16.75 C8.1 37.02,14.88 C7.+ 34.66,14.29 ETH2.P$15 31.71,14.8 ETH2.P$11
  Bottom 0.61: SV2.5 46.52,7.22 46.25,7.5 43.75,7.5 41.75,9.5 41.75,30 40.75,31 v38,31 | ETH2.P$15 ETH2.P$14 | v37.25,16.75 37.25,29.75 v36,31
  other vias: 14,41 16,41 16,39 14,39 14,37 16,37 18,37 20,37 22,37 24,37 26,37 28,37 30,37 32,37 34,37 36,37 32,39 38,37 38,39 38,35 36,35 34,35 32,35 30,35 28,35 26,35 24,35 22,35 20,35 18,35 16,35 14,35 14,33 16,33 18,33 20,33 22,33 24,33 26,33 28,33 30,33 32,33 34,33 36,33 38,33 34,31 32,31 30,31 28,31 26,31 24,31 22,31 20,31 18,31 16,31 14,31 25,39 25,41
  pour Bottom (isolate 0.254, no thermals): 12.75,42.5 12.75,28.75 40.25,28.75 40.25,42.5
  pour Top (isolate 0.254, no thermals): 18.75,42.5 12.75,42.5 12.75,28.75 40.25,28.75 40.25,42.25 40.25,42.5
5V_BTTM
  pour Top (isolate 0.254, no thermals): 22.5,60.75 22.5,50 22.25,49.75 18.25,49.75 18,49.5 18,46 19.5,46 19.5,48.25 19.75,48.5 25,48.5 25.25,48.25 25.25,46 26.75,46 26.75,60.75
12V_BTTM
  Top 0.61: D6.K 44.25,71.56 44.75,72.06 RLY5.1 | RLY4.1 44.56,60.31 44.25,60 D2.K | RLY3.1 44.56,48.56 44.25,48.25 D1.K | RLY2.1 44.56,36.81 44.25,36.5 D4.K | RLY1.1 44.56,25.06 44.25,24.75 D3.K | R7.2 24.45,67.2 24.75,67.5
  Bottom 0.61: RLY4.1 51.69,60.31 52.5,59.5 | RLY3.1 51.69,48.56 52.5,47.75 | RLY2.1 51.44,36.81 52.5,35.75 | RLY1.1 51.69,25.06 52.5,24.25
  Bottom 1.27: RLY5.1 51.94,72.06 52.5,71.5 52.5,59.5 52.5,47.75 52.5,35.75 52.5,24.25 52.5,14.5 53,14 59.5,14 61.5,12 61.5,6.29 SV2.17 SV2.19
  pour Top (isolate 0.254, no thermals): 23.75,73.75 50.25,73.75 50.5,73.5 50.5,70.25 50.25,70 27,70 26.75,69.75 26.75,64.5 26.5,64.25 22.5,64.25 22.5,65.75 23.5,65.75 23.75,66
12V_BTTM_HEADER
  Top 0.61: R7.1 D5.A
36V
  pour Top (isolate 0.254, no thermals): 29,93.75 37.25,93.75 40.5,93.75 40.5,91.25 40.25,91 36.25,91 36,90.75 36,87.25 34,87.25 34,90.75 33.75,91 29,91
+3V3  (via drill 0.4)
  Top 0.305: R4.2 135.05,32.7 135,32.75 | R59.2 135.2,40.7 135,40.5 | R57.2 135.05,48.95 135,49 | R55.2 135.05,56.45 135,56.5 | R6.2 121.5,12.75 | R3.2 121.41,10.16 121.5,10.25 | C1.1 IC1.28
  Top 0.406: 119.92,73.8 IC1.7 v119.92,78.86 119.92,80.58 119.12,81.38 IC1.28 | 119.92,73.8 C2.1 | 119.92,73.8 119.92,70.58 120.5,70 134.5,70 v135,69.5 135,63.05 R53.2 | v129,87.25 R11.2
  Top 0.61: v135,14.25 135,32.75 135,40.5 135,49 135,56.5 135,62.95 R53.2 | v124,14 121.75,14 121.5,13.75 121.5,12.75 121.5,10.25 121.5,6.04 SV1.5
  Bottom 0.406: v135,69.5 135,78 | 135,78 135,87.25 134.64,87.61 ICSP.2 129.36,87.61 v129,87.25 | v119.92,78.86 119.92,78.83 120.25,78.5 134.5,78.5 135,78
  Bottom 0.61: v135,14.25 134.75,14 v124,14
+12V  (via drill 0.4)
  Top 0.305: R19.1 117.45,31 R8.2 | R18.1 R9.2 | R16.1 R10.2 | R17.1 R12.2 | R13.2 126.5,63.25 126.75,63.5 R1.2 | R20.1 117.7,23.25 117.2,22.75
  Top 0.61: IC7.9 97.45,16.8 98.5,15.75 v117.75,15.75
  Top 1.016: R14.1 R13.2 R12.2 R10.2 R9.2 R8.2 117.2,22.75 117.2,16.3 v117.75,15.75
  Bottom 1.016: SV1.19 SV1.17 136.72,14.79 135.75,15.75 v117.75,15.75
EX_IN0_UP
  Top 0.254: SV1.20 140.48,3.48 140.75,3.75 140.75,7 133.25,14.5 133.25,55.75 132.75,56.25 126.8,56.25 R54.1
  Top 0.305: R17.2 126.5,55.25 126.75,55.5 R54.1
EX_IN1_UP
  Top 0.254: SV1.18 137.73,3.48 138,3.75 138,7 132.75,12.25 132.75,47.25 132,48 126.8,48 R56.1
  Top 0.305: R16.2 126.5,47.25 126.75,47.5 R56.1
EX_IN2_UP
  Top 0.254: SV1.16 135.23,3.48 135.5,3.75 135.5,7 132.25,10.25 132.25,39.5 131.75,40 126.8,40 R58.1
  Top 0.305: R18.2 126.5,39.25 126.75,39.5 R58.1
EX_IN3_UP
  Top 0.254: SV1.14 132.48,3.48 132.88,4 132.88,7.62 131.75,8.75 131.75,31.75 131.5,32 126.8,32 R60.1
  Top 0.305: R19.2 126.5,31 126.75,31.25 R60.1
EX_IN4_UP
  Top 0.254: SV1.12 129.48,3.48 130.38,4.38 130.38,23.62 129.88,24.12 126.83,24.12
  Top 0.305: R20.2 126.5,23.25 126.75,23.5 R5.1 126.83,24.12
GND  (via drill 0.4)
  other vias: 16,52 20,52 16,48 16,44 36,56 40,56 40,52 36,52 36,48 40,48 8,52 4,52 16,20 20,20 28,20 32,20 24,20 4,20 4,12 4,4 16,4 20,4 44,100 36,100 32,100 52,100 60,100 68,100 84,96 84,100 64,100 56,100 72,100 72,96 64,96 56,96 56,88 64,88 72,88 64,80 56,80 52,96 52,92 56,92 52,88 56,84 52,84 52,80 48,92 48,96 44,96 44,92 44,77 46,77 48,77 50,77 52,77 54,77 54,80 54,84 54,82 52,82 56,82 52,86 54,86 54,88 56,86 52,90 54,90 56,90 54,92 50,92 46,92 46,94 44,94 48,94 50,94 52,94 54,94 56,94 56,77 38,56 38,54 36,54 40,54 38,52 36,50 38,50 38,48 40,50 37.5,11.5 38,7 38,4 39,11.5 32,22.5 28,22.5 24,22.5 20,22.5 16,22.5 30,100 30,101.5 32,101.5 30,96.5 20.5,89 22,89 22,87.5 20.5,87.5 20.5,86 22,86 28.5,101.5 28.5,100 26.5,62.5 25,62.5 23.5,62.5 22,62.5 20.5,62.5 13,67 14.25,67
  pour Bottom (isolate 0.254, rank 2, no thermals): 0,59.25 0,0 51.75,0 51.75,14.25 43.25,14.25 43.25,75.5 64.75,75.5 75.75,86.5 86.75,86.5 86.75,102.75 27,102.75 27,90.5 19.5,90.5 19.5,68.5 12.25,68.5 11.75,68 11.75,59.25
  pour Top (isolate 0.254, rank 2, no thermals): 0,59.25 0,0 51.75,0 51.75,14.25 43.25,14.25 43.25,75.5 64.75,75.5 75.75,86.5 86.75,86.5 86.75,102.75 27,102.75 27,90.5 19.5,90.5 19.5,68.5 12.25,68.5 11.75,68 11.75,59.25
GNDI
  Top 0.406: X9.2 13.59,61.97 R15.1
  Bottom 0.406: SV2.10 51.6,1.85 51.25,1.5 36.25,1.5 35.75,2 35.75,24.25 35.25,24.75 12.25,24.75 11.75,25.25 11.75,61.25 11,62 5.66,62 X9.2
IN0
  Top 0.254: X1.1 10.05,45.7 10.5,45.25 10.5,27.5 10.75,27.25 40,27.25 40.75,26.5 40.75,14.75 41.25,14.25 62.75,14.25 63,14 63,4.79 SV2.20
IN0_UP
  Top 0.305: OK8.4 137.24,62.71 R53.1 136.95,70.8 136.75,71 121,71 120.72,71.28 IC1.8
IN1
  Top 0.254: X1.2 9.38,40.62 9.75,40.25 9.75,27 10,26.75 39.75,26.75 40.25,26.25 40.25,14.5 41,13.75 60,13.75 60.5,13.25 60.5,4.75 SV2.18
IN1_UP
  Top 0.305: OK1.4 137.05,54.5 R55.1 138.55,54.55 139,55 139,71.25 138.5,71.75 121.75,71.75 121.53,71.97 IC1.9
IN2
  Top 0.254: X1.3 8.71,35.54 9,35.25 9,26.5 9.25,26.25 39.5,26.25 39.75,26 39.75,14.25 40.75,13.25 57.5,13.25 57.88,12.88 57.88,4.83 SV2.16
IN2_UP
  Top 0.305: OK2.4 R57.1 139.55,47.05 139.75,47.25 139.75,72 139.25,72.5 122.5,72.5 122.33,72.67 IC1.10
IN3
  Top 0.254: X1.4 7.79,30.46 8.25,30 8.25,26 8.5,25.75 39,25.75 39.25,25.5 39.25,14 40.5,12.75 55,12.75 55.38,12.38 55.38,4.79 SV2.14
IN3_UP
  Top 0.305: OK3.4 R59.1 140.05,38.8 140.5,39.25 140.5,72.75 140,73.25 127.5,73.25 127.25,73.5 127.25,78.5 126.85,78.9 IC1.14
IN4
  Top 0.254: X1.5 5.76,25.25 38.5,25.25 38.75,25 38.75,13.75 40.25,12.25 52.5,12.25 52.88,11.88 52.88,4.75 SV2.12
IN4_UP
  Top 0.305: OK4.4 R4.1 140.8,30.8 141.25,31.25 141.25,73.5 140.75,74 128.25,74 128,74.25 128,79.25 127.55,79.7 IC1.15
MCLR
  Top 0.305: IC1.18 126.97,82.1 C3.1 128.82,82.38 R11.1 130.05,82.55 130.5,83 130.5,89.75 130.9,90.15 ICSP.1
N$1
  Top 0.254: R2.2 18.95,57.25 LED2.A
N$2
  Top 1.016: FUSE.OUT 9.72,69.72 10.5,70.5 10.5,90 11,90.5 16.52,90.5 MOV.2 16.75,90.73 16.75,92.5 17.38,93.13 DB1.P$2
N$3
  Top 1.016: DB1.P$1 18.01,98.25 MOV.1 5.96,98.15 X2.1
N$4
  Top 1.016: X2.2 5.58,85.1 FUSE.IN
N$5
  Top 0.305: OK4.1 122.11,28.64 LED13.K
N$6
  Top 0.305: LED1.A 126.7,67.25 R1.1
N$7
  Top 0.305: IC7.11 100,66.75 100.5,67.25 LED12.K
N$8
  Bottom 0.305: ETH2.P$16 ETH2.P$12
N$9
  Bottom 0.305: ETH2.P$13 ETH2.P$7
N$10
  Top 0.305: LED13.A 126.72,25.98 R5.2
N$11
  Top 0.305: LED10.A 115.27,31.22 R8.1
N$12
  Top 0.61: X9.1 15.94,56.88 D5.K
N$13
  Top 0.305: R9.1 115.3,35.28 LED8.A
N$14
  Top 0.305: R10.1 115.3,43.28 LED3.A
N$16
  Top 0.305: R12.1 115.3,51.28 LED7.A
N$17
  Top 0.305: R13.1 115.3,59.53 LED9.A
N$18
  Top 0.305: R14.2 115.3,67.28 LED12.A
N$46
  Top 0.305: OK8.1 122.14,60.63 LED5.K
N$47
  Top 0.305: LED5.A 126.72,58.23 R54.2
N$49
  Top 0.305: LED4.K 130.56,52.52 OK1.1
N$50
  Top 0.305: LED4.A 126.72,49.98 R56.2
N$51
  Top 0.305: OK2.1 122.11,44.63 LED6.K
N$52
  Top 0.305: LED6.A 126.72,41.98 R58.2
N$53
  Top 0.305: OK3.1 122.14,36.38 LED11.K
N$54
  Top 0.305: LED11.A 126.72,33.98 R60.2
N$216
  pour Top (isolate 0.254, no thermals): 34,86.5 36,86.5 36,85.5 32.75,85.5 32.5,85.25 32.5,80.25 23.75,80.25 23.75,83.75 28,83.75 28.5,84.25 28.5,89 28.75,89.25 32.5,89.25 32.75,89 32.75,86.75 33,86.5
N$219
  Top 0.254: IC2.4 33.54,82.54 33.25,82.25 33.25,78.25 33.5,78 34.55,78 R111.1 34.8,75.25 R68.2
NC1_1
  Top 1.778: RLY5.3 57.77,66.52 59.5,68.25 67.75,68.25 77.06,77.56 X8.2
  Bottom 1.778: RLY5.3 57.77,66.52 59.5,68.25 67.75,68.25 76.75,77.25 77,77.5 77.06,77.56 X8.2
NC1_2
  Top 1.778: RLY5.4 65.81,72.06 76.39,82.64 X8.1
  Bottom 1.778: RLY5.4 65.81,72.06 76,82.25 76.25,82.5 76.39,82.64 X8.1
NC2_1
  Top 1.778: RLY4.3 57.77,55.27 59,56.5 71,56.5 76.76,62.26 X4.2
  Bottom 1.778: RLY4.3 57.77,55.27 59,56.5 71,56.5 76.76,62.26 X4.2
NC2_2
  Top 1.778: RLY4.4 69.56,60.31 76.59,67.34 X4.1
  Bottom 1.778: RLY4.4 69.56,60.31 76.59,67.34 X4.1
NC3_1
  Top 1.778: RLY1.3 57.77,19.77 59,21 67.5,21 78.45,10.05 X5.2
  Bottom 1.778: RLY1.3 57.77,19.77 59,21 67.5,21 78.45,10.05 X5.2
NC3_2
  Top 1.778: RLY1.4 67.94,25.06 77.87,15.13 X5.1
  Bottom 1.778: RLY1.4 67.94,25.06 77.87,15.13 X5.1
NC4_1
  Top 1.778: RLY2.3 57.77,31.77 58.75,32.75 70.5,32.75 77.94,25.31 X6.2
  Bottom 1.778: RLY2.3 57.77,31.77 58.75,32.75 70.5,32.75 77.94,25.31 X6.2
NC4_2
  Top 1.778: RLY2.4 71.94,36.81 78.36,30.39 X6.1
  Bottom 1.778: RLY2.4 71.94,36.81 78.36,30.39 X6.1
NC5_1
  Top 1.778: RLY3.3 57.77,43.27 59.5,45 75.75,45 80,40.75 80.19,40.56 | 80.19,40.56 80.25,40.5 | X7.2 80.19,40.56
  Bottom 1.778: RLY3.3 57.77,43.27 59.5,45 75.75,45 80.25,40.5 81.25,40.5
NC5_2
  Top 1.778: RLY3.4 78.36,48.56 X7.1
  Bottom 1.778: RLY3.4 78.19,48.56 81.11,45.64 X7.1
NO1
  Top 1.778: X8.3 76.73,72.48 68.69,64.44 RLY5.5
  Bottom 1.778: RLY5.5 68.69,64.44 76.75,72.5 76.77,72.48 X8.3
NO2
  Top 1.778: RLY4.5 72.44,52.69 76.93,57.18 X4.3
  Bottom 1.778: RLY4.5 72.44,52.69 76.93,57.18 X4.3
NO3
  Top 1.778: RLY1.5 65.81,17.44 78.28,4.97 X5.3
  Bottom 1.778: RLY1.5 65.81,17.44 78.25,5 81.25,5
NO4
  Top 1.778: RLY2.5 68.56,29.19 77.52,20.23 X6.3
  Bottom 1.778: RLY2.5 68.56,29.19 77.5,20.25 81.25,20.25
NO5
  Top 1.778: RLY3.5 73.81,40.94 79.27,35.48 X7.3
  Bottom 1.778: RLY3.5 73.81,40.94 79.25,35.5 81.25,35.5
OSC1
  Top 0.305: IC1.30 117.53,93.03 118.25,93.75 Q3.1 121.75,93.83 C31.2
OSC2
  Top 0.305: IC1.31 116.72,93.03 116,93.75 113,93.75 112.75,93.5 112.42,93.5 Q3.2 111.75,94.17 C32.2
PGC
  Top 0.305: IC1.16 132.19,80.5 ICSP.5
PGD
  Top 0.305: IC1.17 130.3,81.3 131.53,82.53 ICSP.4
RELOAD
  Top 0.254: SV2.4 43.98,1.99 43.75,1.75 25.25,1.75 24.5,2.5 24.5,15.5 24.82,15.82 ETH2.P$6
RELOAD_UP
  Top 0.305: SV1.2 96.02,3.48 95.5,4 95.5,79.6 Q8.C
RELOAD_UP_IO
  Top 0.305: IC1.37 104.4,82.9 103.25,81.75 R79.1
RI1
  Top 0.305: IC1.43 112.35,78.1 106.34,72.09 IC7.1
RI2
  Top 0.305: IC1.42 111.9,78.9 105.08,72.08 IC7.2
RI3
  Top 0.305: IC1.41 111.45,79.7 103.81,72.06 IC7.3
RI4
  Top 0.305: IC1.40 111,80.5 102.53,72.03 IC7.4
RI5
  Top 0.305: IC1.39 110.55,81.3 101.25,72 101.25,70.54 IC7.5
RO1
  Top 0.61: RLY1.2 44.56,17.44 44.25,17.75 D3.A
  Bottom 0.61: RLY1.2 47.61,13.27 48.25,12.62 58.5,12.62 59.23,11.9 SV2.15
RO1_UP  (via drill 0.4)
  Top 0.305: LED10.K 106.75,27.5 v106.34,27.91
  Top 0.61: IC7.16 v106.34,27.91
  Bottom 0.61: v106.34,27.91 106.34,13.15 106.75,12.75 133,12.75 134.18,11.57 SV1.15
RO2
  Top 0.61: D4.A 44.25,29.75 44.75,29.25 47.55,29.25 RLY2.2
  Bottom 0.61: RLY2.2 46.44,29.19 45.75,28.5 45.75,12.12 46.25,11.62 56.12,11.62 56.69,11.06 SV2.13
RO2_UP  (via drill 0.4)
  Top 0.61: IC7.15 v105.08,35.83
  Bottom 0.305: LED8.K 105.65,35.25 v105.08,35.83
  Bottom 0.61: v105.08,35.83 105.08,11.93 105.25,11.75 130.75,11.75 131.63,10.87 SV1.13
RO3
  Top 0.61: D1.A 44.25,41.25 44.5,41 47.55,41 RLY3.2
  Bottom 0.61: RLY3.2 45.19,40.94 44.75,40.5 44.75,11.38 45.5,10.62 53.62,10.62 54.15,10.11 SV2.11
RO3_UP  (via drill 0.4)
  Top 0.61: IC7.14 v103.81,43.95
  Bottom 0.305: LED3.K 104.5,43.25 v103.81,43.95
  Bottom 0.61: v103.81,43.95 103.81,11.2 104.25,10.75 128.25,10.75 129.09,9.9 SV1.11
RO4
  Top 0.61: D2.A 44.25,53.19 44.75,52.69 RLY4.2
  Bottom 0.61: RLY4.2 43.94,52.69 43.75,52.5 43.75,10.62 44.75,9.62 51,9.62 51.6,9.02 SV2.9
RO4_UP  (via drill 0.4)
  Top 0.61: IC7.13 v102.53,51.97
  Bottom 0.305: LED7.K 103.25,51.25 v102.53,51.97
  Bottom 0.61: v102.53,51.97 102.53,10.21 103,9.75 125.75,9.75 126.56,8.95 SV1.9
RO5
  Top 0.61: D6.A 44.25,64.69 44.5,64.44 RLY5.2
  Bottom 0.61: RLY5.2 43.44,64.44 42.75,63.75 42.75,10.12 44.25,8.62 48.62,8.62 49.06,8.19 SV2.7
RO5_UP  (via drill 0.4)
  Top 0.61: IC7.12 v101.27,60.23
  Bottom 0.305: LED9.K 102,59.5 v101.27,60.23
  Bottom 0.61: 101.27,59.98 v101.27,60.23 101.27,9.23 101.75,8.75 123.5,8.75 124.02,8.23 SV1.7
RST
  Top 0.254: SV2.2 41.45,2.69 41.25,2.5 25.75,2.5 25.25,3 25.25,11.5 25.5,11.75 ETH2.P$4
RST_UP
  Top 0.305: SV1.4 118.94,2.19 118.75,2 95.25,2 94.75,2.5 94.75,85 95,85.25 Q9.C
RST_UP_IO
  Top 0.305: IC1.36 103,83.7 R80.1
RX  (via drill 0.4)
  Top 0.305: R3.1 118.85,6.11 SV1.3 | IC1.1 115.12,73.38 v114.75,73
  Bottom 0.305: SV1.3 118.94,7.07 118.5,7.5 100.25,7.5 100,7.75 100,71.75 100.5,72.25 114,72.25 v114.75,73
RX_ETH
  Top 0.254: ETH2.P$8 32.25,9.25 41,9.25 41.45,8.8 SV2.1
STATUS
  Top 0.305: IC1.38 109.85,82.1 100,72.25 IC7.6
TX  (via drill 0.4)
  Top 0.305: SV1.1 116.39,12.39 116.75,12.75 R6.1 | IC1.44 112.55,77.3 112.25,77 v112.25,74.5
  Bottom 0.305: SV1.1 99.98,6.02 99.25,6.75 99.25,72.25 100.25,73.25 111.75,73.25 112.25,73.75 v112.25,74.5
TX_ETH
  Top 0.254: ETH2.P$9 29.68,9.68 30,10 43.5,10 44,9.5 44,6.04 SV2.3
TXD2
  Top 0.305: R79.2 R82.1 98.55,79.5 Q8.B
TXD3
  Top 0.305: R81.1 R80.2 98.4,84.25 Q9.B
VSS  (via drill 0.4)
  Top 0.305: OK8.2 129.37,59.37 v129,59 | OK1.2 129.26,51.27 v129,51 | OK2.2 129.37,43.37 v129,43 | OK3.2 129.37,35.12 v129,34.75 | OK4.2 129.37,27.36 v129,27
  Bottom 0.61: SV1.10 126.56,2.19 127.25,1.5 140.5,1.5 141,2 141,17 140,18 129.5,18 129,18.5 v129,27 v129,34.75 v129,43 v129,51 v129,59
(copper drawn outside any net)
  shapes: Top area x6

### Text on the board
Top: www.pilotelektronik.com
tPlace: B.D. | B.D. | www.pilotelektronik.com | www.pilotelektronik.com | V1.0 | V1.0